# EAGLE design openevse-ac-filter (EAGLE 9.6.2)
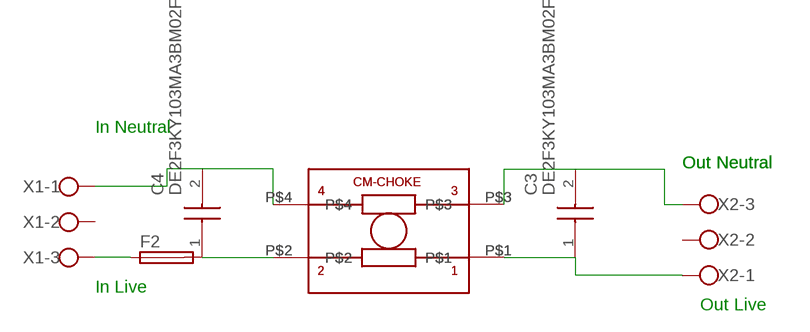
[diagram p0: schematic, sheet 1]

## Parts
C3  DE2F3KY103MA3BM02F  [DE2F3KY103MA3BM02F]
C4  DE2F3KY103MA3BM02F  [DE2F3KY103MA3BM02F]
F2  GSH15  [GSH15]
U$1  47mH  RN114-0.3-02-47M  [RN114-0.3-02-47M]
U$2  RN214-0.3-02-47M  [RN214-0.3-02-47M]
X1  W237-103  [W237-103]
X2  W237-103  [W237-103]

## Nets
N$3: C3.2 U$1.P$3 U$2.P$3 X2.3
N$5: F2.1 X1.3
N$17: C4.2 U$1.P$4 U$2.P$4 X1.1
N$21: C3.1 U$1.P$1 U$2.P$1 X2.1
N$22: C4.1 F2.2 U$1.P$2 U$2.P$2
Unconnected: X1.2 X2.2

## Notes on the sheet
- In Neutral
- Out Neutral | Out Neutral
- In Live
- Out Live

## Library data of the parts
C3 C4 = DE2F3KY103MA3BM02F:DE2F3KY103MA3BM02F: Murata Single Layer Ceramic Capacitor SLCC 10nF 250Vrms +/-20% F Dielectric DE2 Series +85C Max Op. Temp. Source: Datasheet <https://psearch.en.murata.com/capacitor/product/DE2F3KY103MA3BM02F.html>; ARROW_PART_NUMBER: DE2F3KY103MA3BM02F; ARROW_PRICE-STOCK: https://www.arrow.com/en/products/de2f3ky103ma3bm02f/murata-manufacturing; DESCRIPTION: Murata Single Layer Ceramic Capacitor SLCC 10nF 250Vrms +/-20% F Dielectric DE2 Series +85C Max Op. Temp.; HEIGHT: 17mm; MANUFACTURER_NAME: Murata Electronics; MANUFACTURER_PART_NUMBER: DE2F3KY103MA3BM02F; MOUSER_PART_NUMBER: 81-DE2F3KY103MA3BM2F; MOUSER_PRICE-STOCK: https://www.mouser.co.uk/ProductDetail/Murata-Electronics/DE2F3KY103MA3BM02F?qs=coxMWmu44UCpS%2FqDCKay7w%3D%3D
F2 = fuse-20mm:GSH15: FUSE HOLDER grid 15mm, 19649 Wickmann; MPN: 64900001039; OC_FARNELL: 1271673; OC_NEWARK: 02P0318
U$1 = Schaffner-CM-Choke:RN114-0.3-02-47M
U$2 = Schaffner-CM-Choke:RN214-0.3-02-47M
X1 X2 = con-wago-500:W237-103: WAGO SCREW CLAMP; MPN: 237-103; OC_FARNELL: unknown; OC_NEWARK: 18M7116

## Board
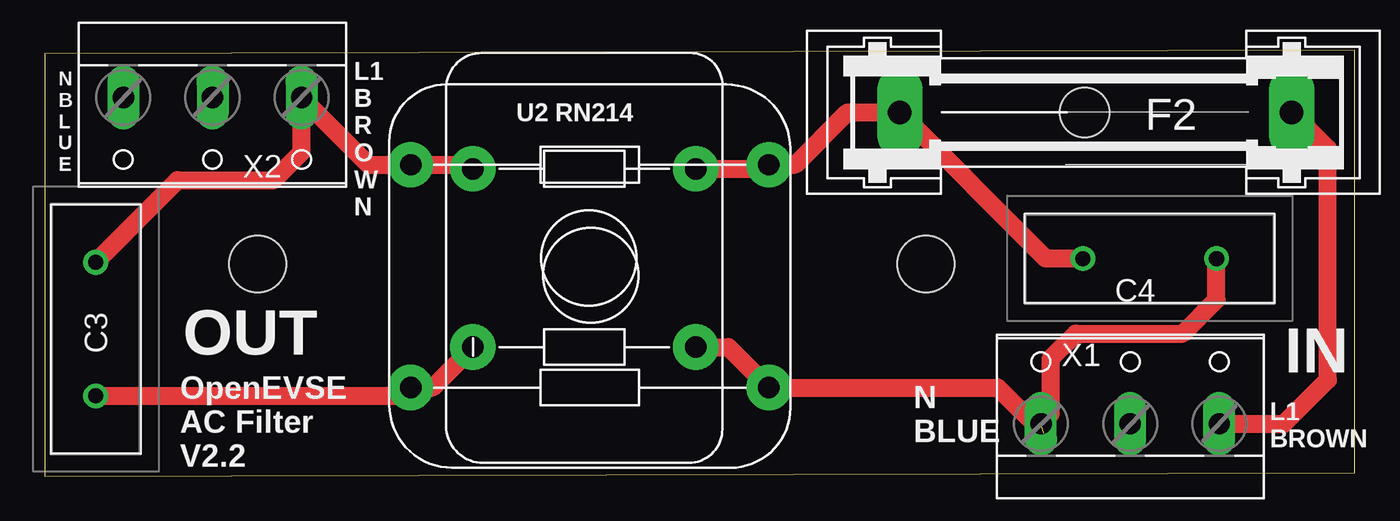
[diagram p1: board, top side]
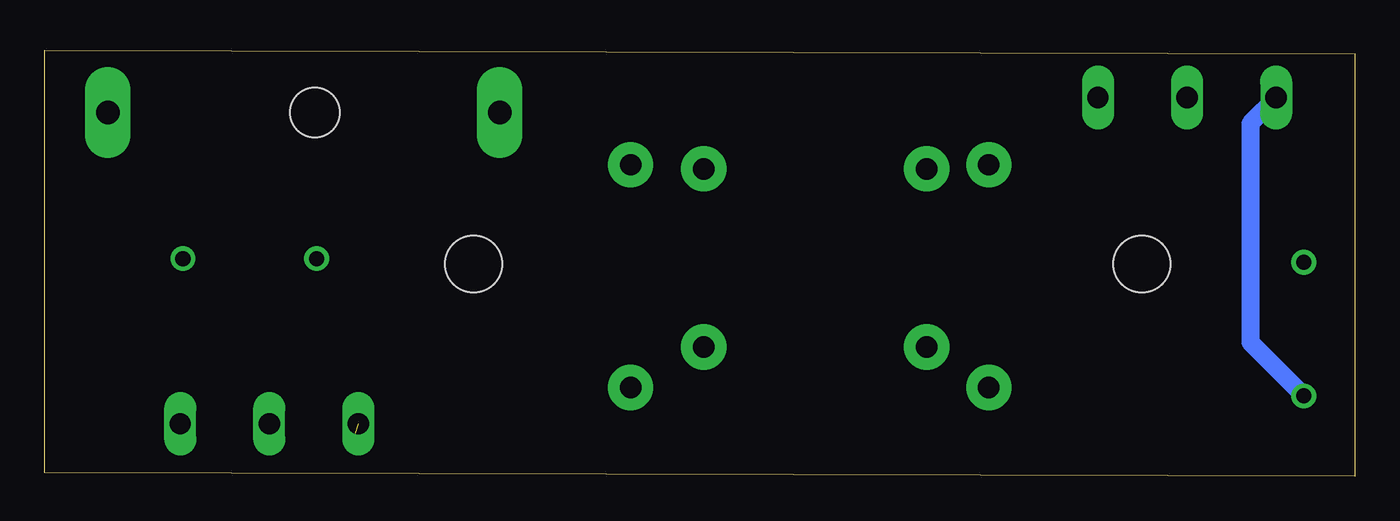
[diagram p2: board, bottom side, seen from below]

Size 73.54 x 23.9 mm. Coordinates in mm from the lower left corner, seen from the top.
Outline: 0,0 73.54,0.2 73.54,23.9 0,23.7 0,0
Copper layers (1*16): Top 0.035mm / dielectric 1.5mm / Bottom 0.035mm
Design rules "default": minimum track width 10mil, minimum drill 24mil, track to track 8mil, track to pad 8mil, pad to pad 8mil, via to via 8mil, smd to smd 8mil, copper to edge 40mil, drill to drill 8mil, minimum pad ring 10mil, minimum via ring 8mil, stop-mask expansion 4mil, vias tented up to drill 0mil, thermal gap 10mil
Holes 3.2 mm at 11.97,11.9 49.47,11.9

### Footprints (pad centres in the part's own frame; a part is rotated, then mirrored left to right if it is on the bottom)
DE2F3KY103MA3BM02F = drill 0.85 pad 1.381: 1 0,0; 2 7.5,0
GSH15 = drill 1.321 pad 2.54 long: 1 -7.62,0; 2 14.38,0 | hole 2.794: 4,0
RN114-0.3-02-47M = drill 1.2 pad 2.54: P$1 9.87,-5.66; P$2 -10.23,-5.66; P$3 9.87,6.84; P$4 -10.23,6.84
RN214-0.3-02-47M = drill 1.2 pad 2.54: P$1 14,6.5; P$2 1.5,6.5; P$3 14,16.5; P$4 1.5,16.5
W237-103 = drill 1.194 long: 1 -5,-1.29; 2 0,-1.29; 3 5,-1.29

### Placement (x,y rotation side)
C3  2.87,12 270 top
C4  58.27,12.2 0 top
F2  62.37,20.4 180 top
U$1  30.42,11.81 180 top
U$2  38.04,23.74 180 top
X1  60.92,4.23 0 top
X2  9.42,19.95 180 top

### Tracks (layer width: path | path; a pad name or v marks a point on that pad's centre or on a via)
N$3
  Top 1.016: C3.2 20.08,4.5 U$1.P$3 21.77,4.97 U$2.P$3
  Bottom 1.016: X2.3 5.87,19.79 5.87,7.5 C3.2
N$5
  Top 1.016: X1.3 69.55,2.94 72.01,5.4 72.01,18.38 F2.1
N$17  (1 unrouted)
  Top 1.016: X1.1 56.47,3.49 56.47,6.6 57.87,8 63.87,8 65.77,9.9 C4.2 | U$2.P$4 38.38,7.24 U$1.P$4 53.5,4.97 56.07,2.4
N$21
  Top 1.016: C3.1 7.47,16.6 12.87,16.6 14.42,18.16 X2.1 18.19,17.47 U$1.P$1 23.81,17.47 U$2.P$1
N$22
  Top 1.016: U$2.P$2 40.42,17.24 U$1.P$2 42.14,17.47 45.07,20.4 F2.2 56.19,12.2 C4.1

### Text on the board
tPlace: N / B / L / U / E | L1 / B / R / O / W / N | OUT | IN | N / BLUE | L1 / BROWN | OpenEVSE / AC Filter / V2.2
tNames: U2 RN214